# Altium schematic sheet Screens.SchDoc
size A4
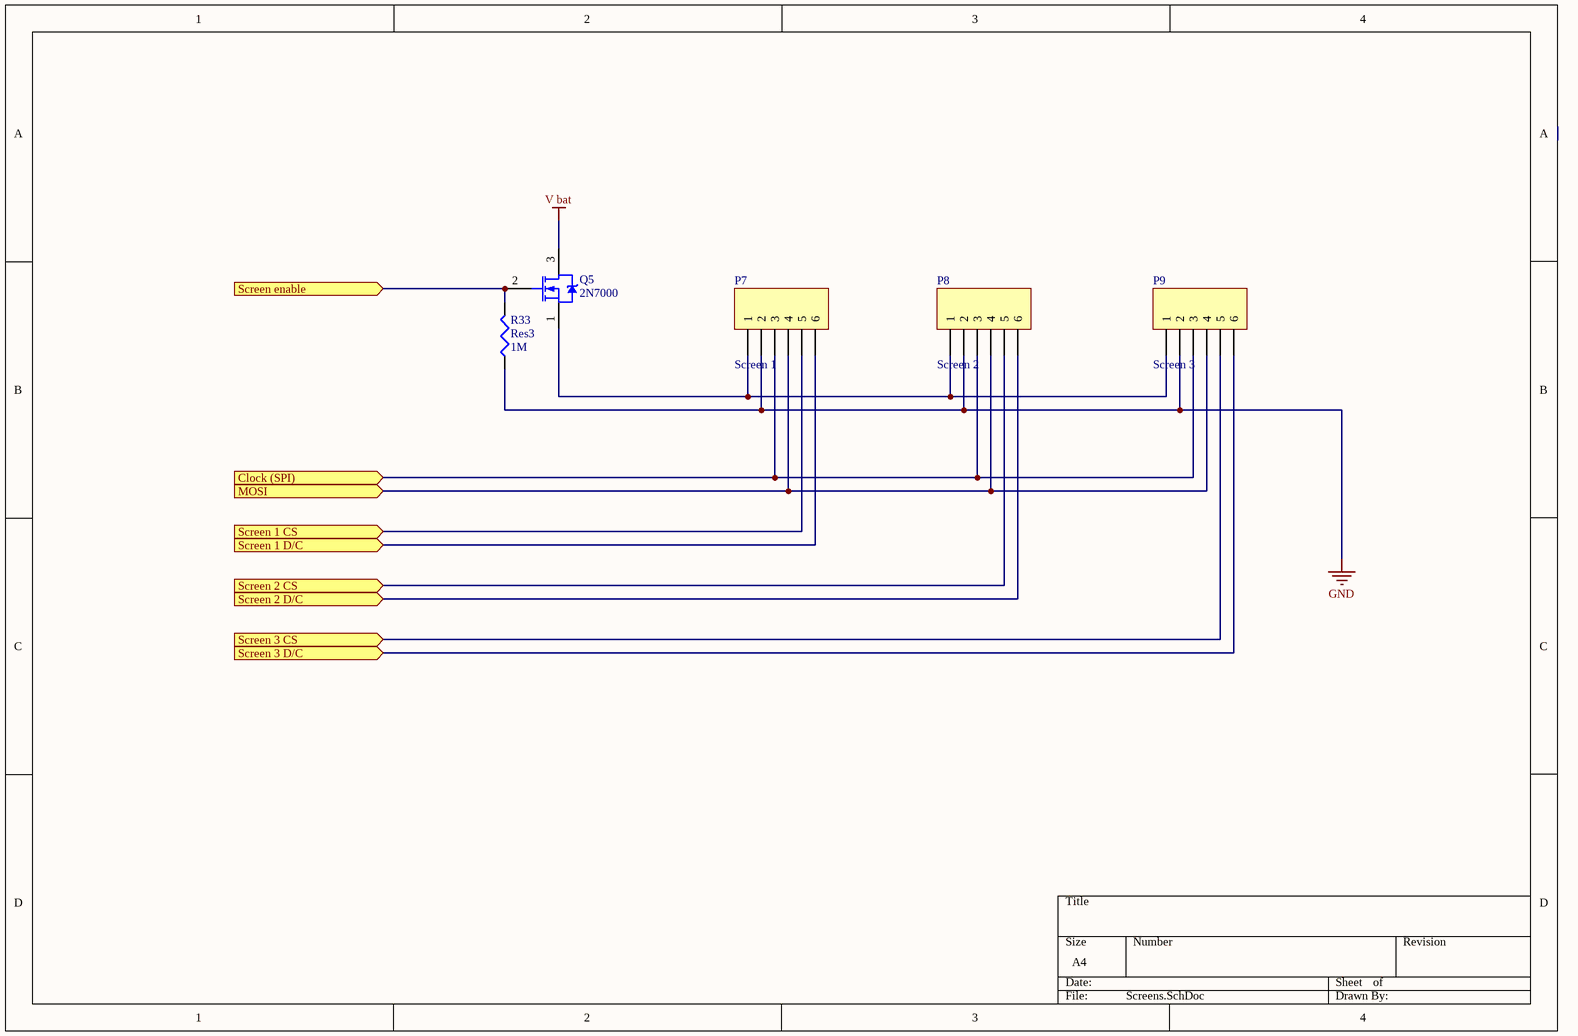
[diagram p0: Screens.SchDoc]

## Parts
P7  Screen 1  [HDR1X6]
P8  Screen 2  [HDR1X6]
P9  Screen 3  [HDR1X6]
Q5  2N7000  [ONSC-SOT-323-3-419-04_V]
R33  Res3  value 1M  [0402]

## Ports
Clock (SPI) (in), MOSI (in), Screen 1 CS (in), Screen 1 D/C (in), Screen 2 CS (in), Screen 2 D/C (in), Screen 3 CS (in), Screen 3 D/C (in), Screen enable (in)

## Nets
GND: P7.2 P8.2 P9.2 R33.1
V bat: Q5.3(D)
Clock (SPI): P7.3 P8.3 P9.3 ; port Clock (SPI)
MOSI: P7.4 P8.4 P9.4 ; port MOSI
Screen 1 CS: P7.5 ; port Screen 1 CS
Screen 1 D/C: P7.6 ; port Screen 1 D/C
Screen 2 CS: P8.5 ; port Screen 2 CS
Screen 2 D/C: P8.6 ; port Screen 2 D/C
Screen 3 CS: P9.5 ; port Screen 3 CS
Screen 3 D/C: P9.6 ; port Screen 3 D/C
Screen enable: Q5.2(G) R33.2 ; port Screen enable
NetP7_1: P7.1 P8.1 P9.1 Q5.1(S)

## Library data of the parts
P7-P9 = Header 6: Header, 6-Pin; LatestRevisionDate: 17-Jul-2002; LatestRevisionNote: Re-released for DXP Platform.; Publisher: Altium Limited
Q5 = 2N7000: Small Signal MOSFET, 200 mA, 60 V, N-Channel, 3-Pin TO-92, Bulk Box; Manufacturer: On Semiconductor; Channel Polarity: N Channel; Ciss Typ (pF): 60; Configuration: Single; Coss Typ (pF): 25; Crss Typ (pF): 5; ID Max (A): 0.2; PD Max (W): 0.35; VGS Max (V): 20; VGS(th) Max (V): 3; DatasheetVersion: Rev. 8; PackageVersion: Rev. AM; PackageReference: TO-92-3-29-11_AM_SL; PackageDescription: 3-Pin Transistor Outline, Body 4.825 x 3.685 mm, Pitch 1.27 mm; Package Type: TO-92; Packing: Bulk Box; V(BR)DSS Min (V): 60; Mounting Technology: Through Hole; PartNumber: 2N7000; ComponentLink1Description: Manufacturer URL; ComponentLink1URL: http://www.onsemi.com/; ComponentLink2Description: Datasheet; ComponentLink2URL: http://www.onsemi.com/pub_link/Collateral/2N7000-D.PDF; ComponentLink3Description: Package Specification; ComponentLink3URL: http://www.onsemi.cn/pub_link/Collateral/2N6426-D.PDF
R33 = Res3: Resistor; Published: 8-Jun-2000; LatestRevisionDate: 29-May-2009; LatestRevisionNote: IPC-7351 Footprint Added.; PackageReference: J1-0603; Publisher: Altium Limited; PackageDescription: Chip Resistor